# Altium schematic sheet PLWD_LTE_SIM.SchDoc: SIM
size A3; Date: Not used; ApprovedBy: Not used; CheckedBy: Not used; Author: Not used; CompanyName: STMicroelectronics; DrawnBy: Not used; Engineer: Not used; Organization: Not used; Address1: Not used; Address2: Not used; Address3: Not used; Address4: Not used; DocumentNumber: 4; Revision: Not used; SheetNumber: 8; SheetTotal: 11; CurrentTime: Not used; CurrentDate: Not used; Time: Not used; DocumentFullPathAndName: Not used; DocumentName: Not used; ModifiedDate: Not used; ImagePath: Not used; ProjectName: Not used; Application_BuildNumber: Not used
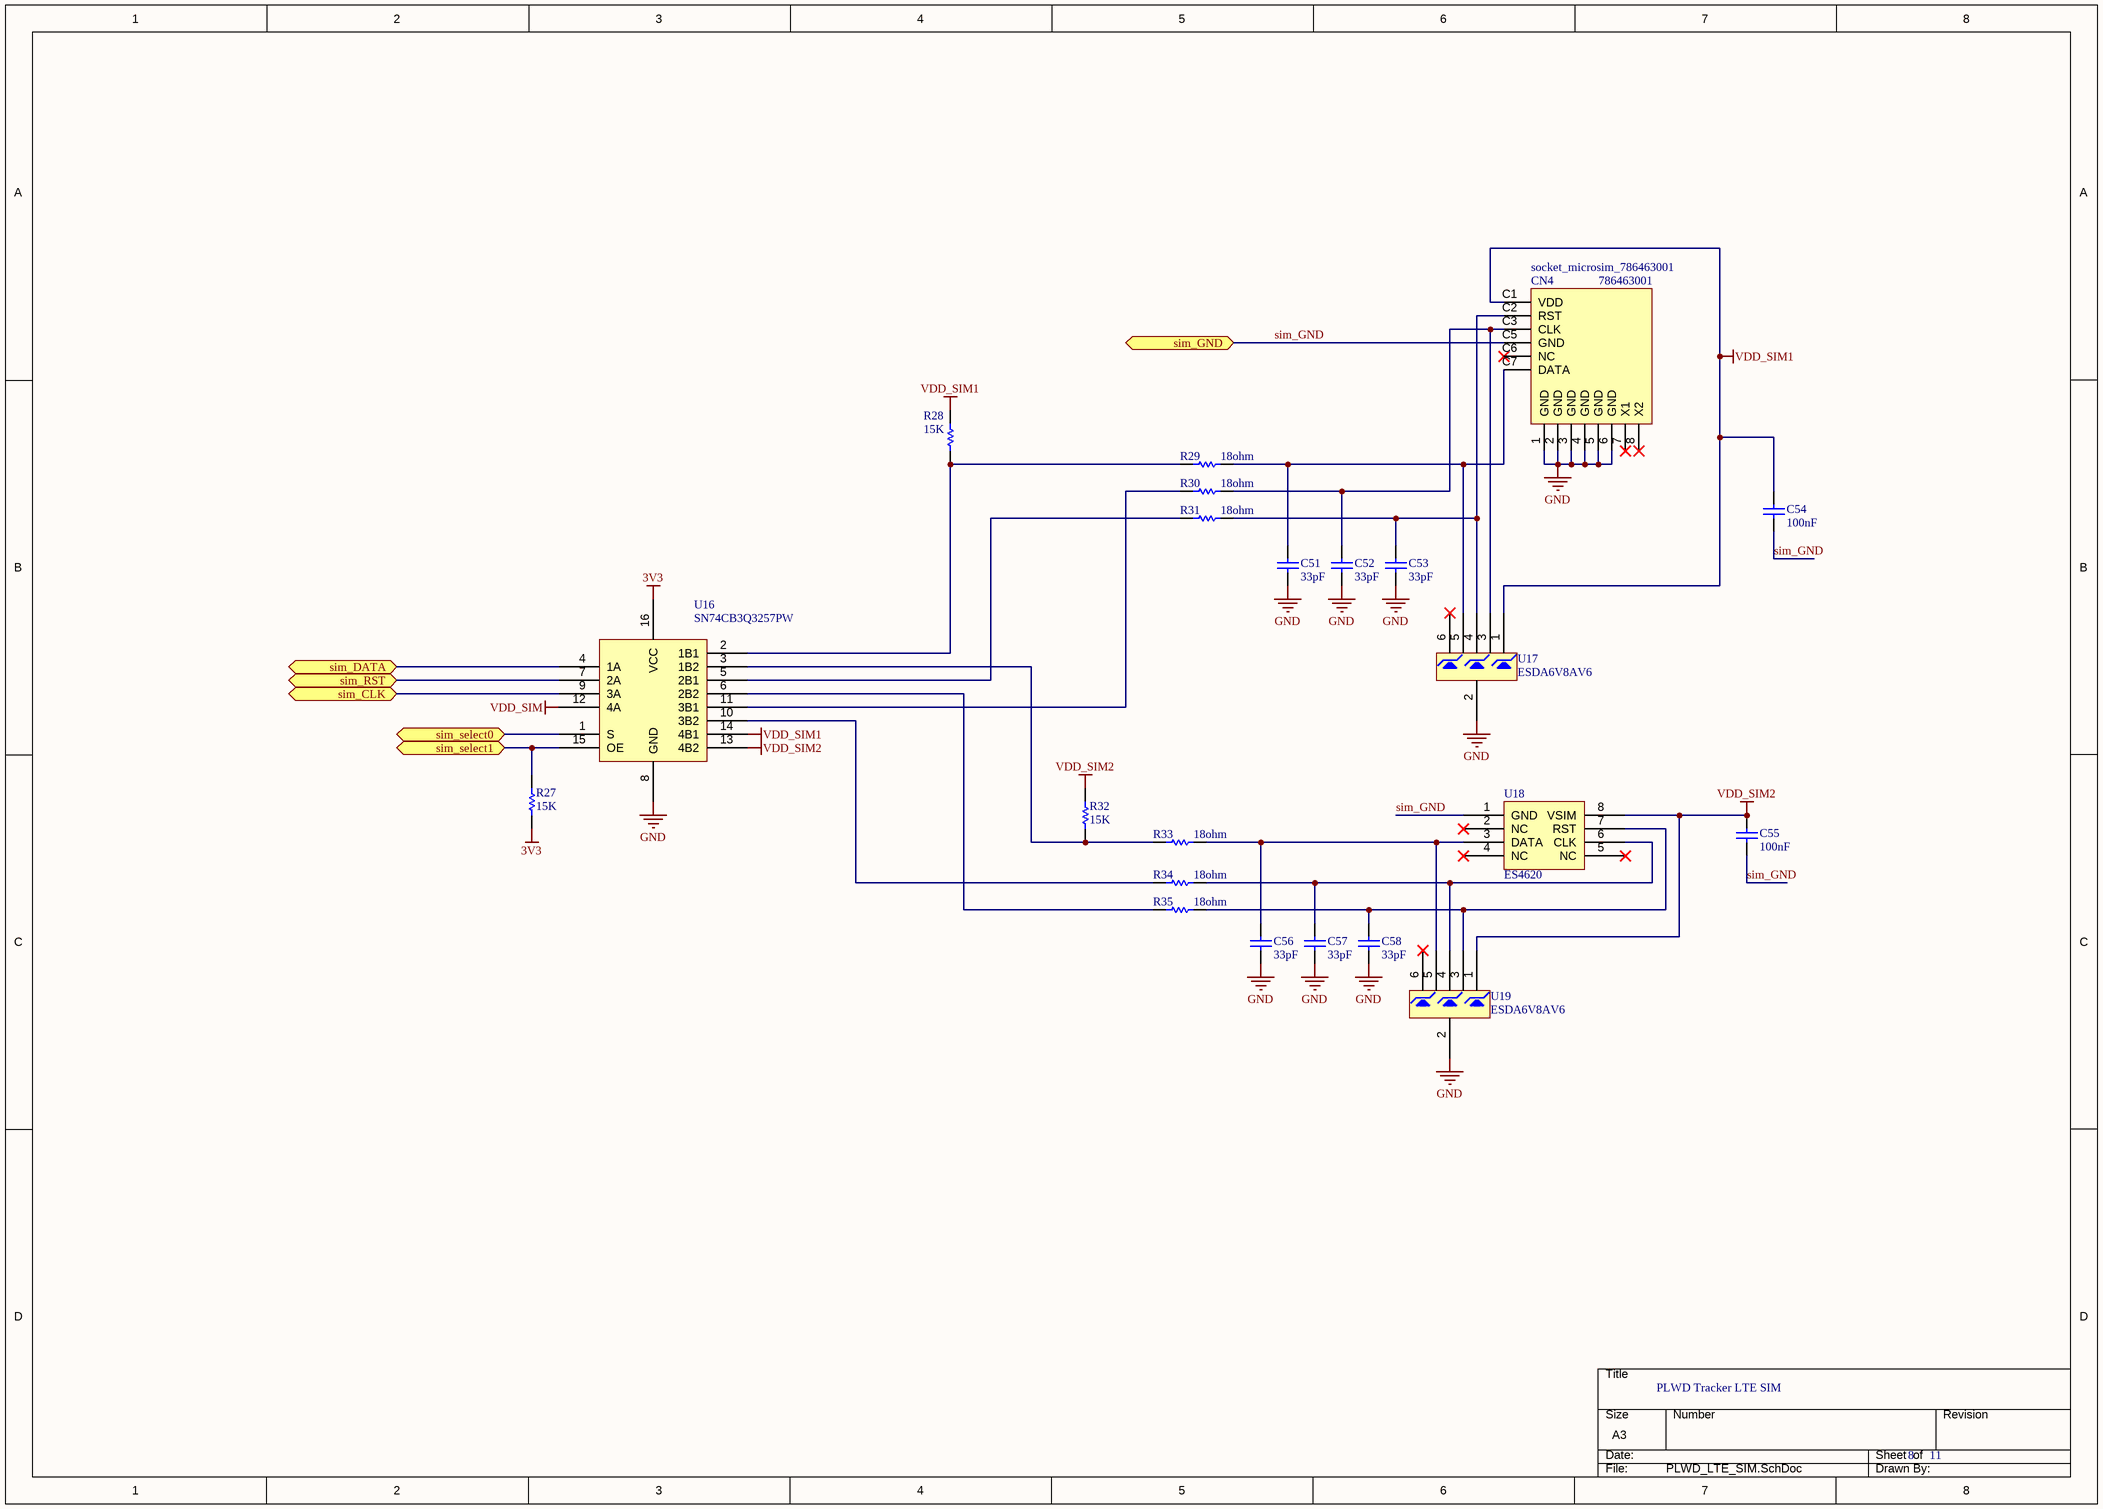
[diagram p0: PLWD_LTE_SIM.SchDoc]

## Parts
C51  value 33pF  [C0402]  (hidden comment: Capacitor)
C52  value 33pF  [C0402]  (hidden comment: Capacitor)
C53  value 33pF  [C0402]  (hidden comment: Capacitor)
C54  value 100nF  [C0402]  (hidden comment: Capacitor)
C55  value 100nF  [C0402]  (hidden comment: Capacitor)
C56  value 33pF  [C0402]  (hidden comment: Capacitor)
C57  value 33pF  [C0402]  (hidden comment: Capacitor)
C58  value 33pF  [C0402]  (hidden comment: Capacitor)
CN4  socket_microsim_786463001  value 786463001  [CON_MICRO-SIMCARD_MOLEX_SD-78646-3001]
R27  value 15K  [R0402]  (hidden comment: Resistor)
R28  value 15K  [R0402]  (hidden comment: Resistor)
R29  value 18ohm  [R0402]  (hidden comment: Resistor)
R30  value 18ohm  [R0402]  (hidden comment: Resistor)
R31  value 18ohm  [R0402]  (hidden comment: Resistor)
R32  value 15K  [R0402]  (hidden comment: Resistor)
R33  value 18ohm  [R0402]  (hidden comment: Resistor)
R34  value 18ohm  [R0402]  (hidden comment: Resistor)
R35  value 18ohm  [R0402]  (hidden comment: Resistor)
U16  SN74CB3Q3257PW  [ICC_TSSOP16_5P1X4P5_P065]
U17  ESDA6V8AV6  [ESD_SOT563-6L_P050]
U18  ES4620  [CON_SIMCARD_ESEYE_ES4620]
U19  ESDA6V8AV6  [ESD_SOT563-6L_P050]

## Ports
sim_CLK (bidir), sim_DATA (bidir), sim_GND (bidir), sim_RST (bidir), sim_select0 (bidir), sim_select1 (bidir)

## Nets
3V3: R27.1 U16.16(VCC)
GND: C51.1 C52.1 C53.1 C56.1 C57.1 C58.1 CN4.1(GND) CN4.2(GND) CN4.3(GND) CN4.4(GND) CN4.5(GND) CN4.6(GND) U16.8(GND) U17.2 U19.2
VDD_SIM: U16.12(4A)
VDD_SIM1: C54.2 CN4.C1(VDD) R28.2 U16.14(4B1) U17.1
VDD_SIM2: C55.2 R32.2 U16.13(4B2) U18.8(VSIM) U19.1
sim_CLK: U16.9(3A) ; port sim_CLK
sim_DATA: U16.4(1A) ; port sim_DATA
sim_GND: C54.1 C55.1 CN4.C5(GND) U18.1(GND) ; port sim_GND
sim_RST: U16.7(2A) ; port sim_RST
sim_select0: U16.1(S) ; port sim_select0
sim_select1: R27.2 U16.15(OE) ; port sim_select1
NetC51_2: C51.2 CN4.C7(DATA) R29.2 U17.5
NetC52_2: C52.2 CN4.C3(CLK) R30.2 U17.3
NetC53_2: C53.2 CN4.C2(RST) R31.2 U17.4
NetC56_2: C56.2 R33.2 U18.3(DATA) U19.5
NetC57_2: C57.2 R34.2 U18.6(CLK) U19.4
NetC58_2: C58.2 R35.2 U18.7(RST) U19.3
NetR28_1: R28.1 R29.1 U16.2(1B1)
NetR30_1: R30.1 U16.11(3B1)
NetR31_1: R31.1 U16.5(2B1)
NetR32_1: R32.1 R33.1 U16.3(1B2)
NetR34_1: R34.1 U16.10(3B2)
NetR35_1: R35.1 U16.6(2B2)

Not connected (* = marked no-connect by the designer): CN4 7(X1)* 8(X2)* C6(NC)*; U17 6*; U18 2(NC)* 4(NC)* 5(NC)*; U19 6*

## Notes on the sheet
- PLWD Tracker LTE SIM
- 8
- 11
- DWG NO:
- REV:
- THIS DOCUMENT AND THE DATA DISCLOSED HEREIN OR
- HEREWITH IS THE PROPERTY OF ALTIUM LIMITED AND MAY
- BE FREELY DISTRIBUTED IN WHOLE. NO RIGHTS ARE
- RESERVED OR EXPRESS OR IMPLIED WARANTEE GIVEN.
- REVISION
- DESCRIPTION
- DATE
- APPROVED
- ENG:
- APPROVALS
- PROJECT
- DSN:
- CHK:
- REFERENCE DOCUMENTS
- PROJECT REVISION:
- TITLE
- DOCUMENT REVISION:
- DESIGN ITEM:
- BOM:
- FAB DWG:
- PCB DWG:
- ASSY DWG:
- SCALE:
- A2
- SIZE
- CAGE CODE
- FILE NAME
- DWG NO.
- SHEET
- OF
- REV

## Library data of the parts
C51-C53 C56-C58 = MCD-00277: capacitor 33pF 50V 5% 0402 COG YAGEO; Manufacturer_Part_Number: CC0402JRNPO9BN330; Provided_By: Subcon; Internal_Part_Number: MCD-00277; PartType: CAP; Manufacturer: YAGEO; ComponentLink1Description: Yageo_COG_series.pdf
C54 C55 = MCD-00006: Capacitor,100nF,16V,X7R,10%,0402,YAGEO; Manufacturer_Part_Number: CC0402KRX7R7BB104; Provided_By: Subcon; Internal_Part_Number: MCD-00006; PartType: Capacitors; Manufacturer: YAGEO; ComponentLink1Description: Yageo_Capacitor_X7R-series.pdf; ComponentLink1URL: Yageo_Capacitor_X7R-series.pdf; ECCN_US: n/a; ECCN_EU: n/a
CN4 = MCD-01019: Socket_microsim 16*13, height 1.45mm; Part_Type: Connector; Manufacturer: MOLEX; Provided_By: Subcon; Initial_Board_Reference: MB1329; Internal_Part_Number: MCD-01019; Status: New; Manufacturer_Part_Number: 786463001; ComponentLink1Description: Micro_Sim_Card_socket_786463001; ComponentLink1URL: http://tunmcdsvn.tun.st.com/Component_Datasheet_Library/Trunk/Connectors/Molex_Connector_Micro_Sim_Card_socket_786463001/Molex_Connector_Micro_Sim_Card_socket_786463001.pdf; ECCN_US: N/A; ECCN_EU: N/A
R27 = MCD-00285: Resistor,15K,0402,5%; Manufacturer_Part_Number: RC0402JR-0715KL; Manufacturer: YAGEO; Provided_By: Subcon; Internal_Part_Number: MCD-00285; PartType: RES; ComponentLink1Description: Yageo_Resistor_RC0402-series.pdf; ECCN_US: n/a; ECCN_EU: n/a
R28 R32 = MCD-00285: resistor, 15K 0402 5%; Manufacturer_Part_Number: RC0402JR-0715KL; Manufacturer: YAGEO; Provided_By: Subcon; Internal_Part_Number: MCD-00285; PartType: RES; ComponentLink1Description: RC_Lseries,pdf
R29-R31 R33-R35 = MCD-00286: resistor, 18 0402 5%; Manufacturer_Part_Number: RC0402jR-0718RL; Manufacturer: YAGEO; Provided_By: Subcon; Internal_Part_Number: MCD-00286; PartType: RES; ComponentLink1Description: RC_Lseries,pdf
U16 = MCD-00287: switch multiplexer; Manufacturer: TEXAS INSTRUMENTS; Provided_By: Subcon; Internal_Part_Number: MCD-00287; Value: SN74CB3Q3257PW; PartType: ICS; Manufacturer_Part_Number: SN74CB3Q3257PW; ComponentLink1Description: SN74CB3Q3257PW.pdf
U17 U19 = MCD-00282: ESD protection; Manufacturer: WILLSEMI; Provided_By: Subcon; Internal_Part_Number: MCD-00282; Value: ESDA6V8AV6; PartType: ICS; Manufacturer_Part_Number: ESDA6V8AV6; ComponentLink1Description: ESDA6V8AV6,pdf
U18 = MCD-00281: embedded SIM; Manufacturer: ESEYE; Provided_By: Subcon; Internal_Part_Number: MCD-00281; Value: ES4620; PartType: ICS; Manufacturer_Part_Number: ES4620; ComponentLink1Description: 8337-AnyNet-Multi-IMSI-SIM-Specification-Sheet.pdf